# EAGLE design 2RelayModule (EAGLE 7.4.0)
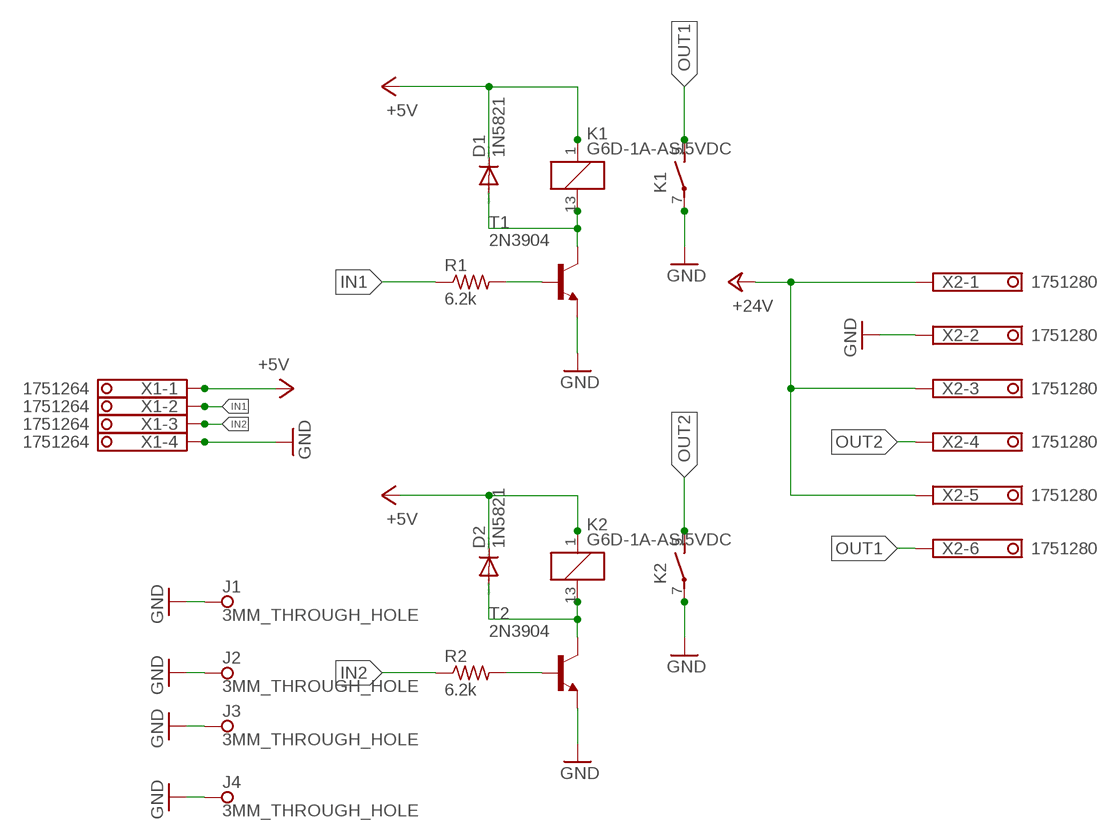
[diagram p0: schematic, sheet 1]

## Parts
D1  1N5821  1N4004  [DO41-10]
D2  1N5821  1N4004  [DO41-10]
J1  3MM_THROUGH_HOLE  [3MM_THROUGH_HOLE]
J2  3MM_THROUGH_HOLE  [3MM_THROUGH_HOLE]
J3  3MM_THROUGH_HOLE  [3MM_THROUGH_HOLE]
J4  3MM_THROUGH_HOLE  [3MM_THROUGH_HOLE]
K1  G6D-1A-ASI5VDC  [G6D]
K2  G6D-1A-ASI5VDC  [G6D]
R1  6.2k  R-US_0207/10  [0207/10]
R2  6.2k  R-US_0207/10  [0207/10]
T1  2N3904  [TO92]
T2  2N3904  [TO92]
X1  1751264  [1751264]
X2  1751280  [1751280]

## Nets
+5V: D1.C D2.C K1.1 K2.1 X1.1
+24V [24V]: X2.1 X2.3 X2.5
GND [GND]: J1.HOLE J2.HOLE J3.HOLE J4.HOLE K1.7(2:P) K2.7(2:P) T1.3(E) T2.3(E) X1.4 X2.2
IN1: R1.1 X1.2
IN2: R2.1 X1.3
N$1: R1.2 T1.2(B)
N$2: R2.2 T2.2(B)
N$3: D1.A K1.13 T1.1(C)
N$4: D2.A K2.13 T2.1(C)
OUT1 [Out]: K1.5(2:S) X2.6
OUT2 [Out]: K2.5(2:S) X2.4

## Library data of the parts
D1 D2 = diode:1N4004: DIODE general purpose rectifier, 1 A
J1-J4 = Genefluidics:3MM_THROUGH_HOLE
K1 K2 = relay:G6D?*: OMRON Slim, Miniature PCB Relay 17.5 × 6.5 × 12.5 mm with Socked Source: http://ecb.omron.com.sg/pdf/relay/power/G6D.pdf; OC_FARNELL: 9812660; OC_NEWARK: unknown
R1 R2 = rcl:R-US_: RESISTOR, American symbol
T1 T2 = transistor:2N3904: NPN TRANSISTOR
X1 = con-phoenix-350:1751264: MKDS 1/ 4-3,5 Printklemme Nennstrom: 10 A Bemessungsspannung: 160 V Raster: 3,5 mm Polzahl: 4 Montageart: Löten Anschlussart: Schraubanschluss Anschlussrichtung vom Leiter zur Platine: 0° Source: http://eshop.phoenixcontact.com .. 1751264.pdf; MPN: 1751264; OC_FARNELL: unknown; OC_NEWARK: 10R0934
X2 = con-phoenix-350:1751280: MKDS 1/ 6-3,5 Printklemme Nennstrom: 10 A Bemessungsspannung: 160 V Raster: 3,5 mm Polzahl: 6 Montageart: Löten Anschlussart: Schraubanschluss Anschlussrichtung vom Leiter zur Platine: 0° Source: http://eshop.phoenixcontact.com .. 1751280.pdf; MPN: 1751280; OC_FARNELL: unknown; OC_NEWARK: 27R1765

## Net classes
0 default: width 0.406 mm, drill 0.508 mm, clearance 0.254 mm
1 24V: width 2.286 mm, drill 0.508 mm, clearance 0.254 mm
2 Out: width 0.889 mm, drill 0.508 mm, clearance 0.254 mm
3 GND: width 0.508 mm, drill 0.508 mm, clearance 0.254 mm

## Board
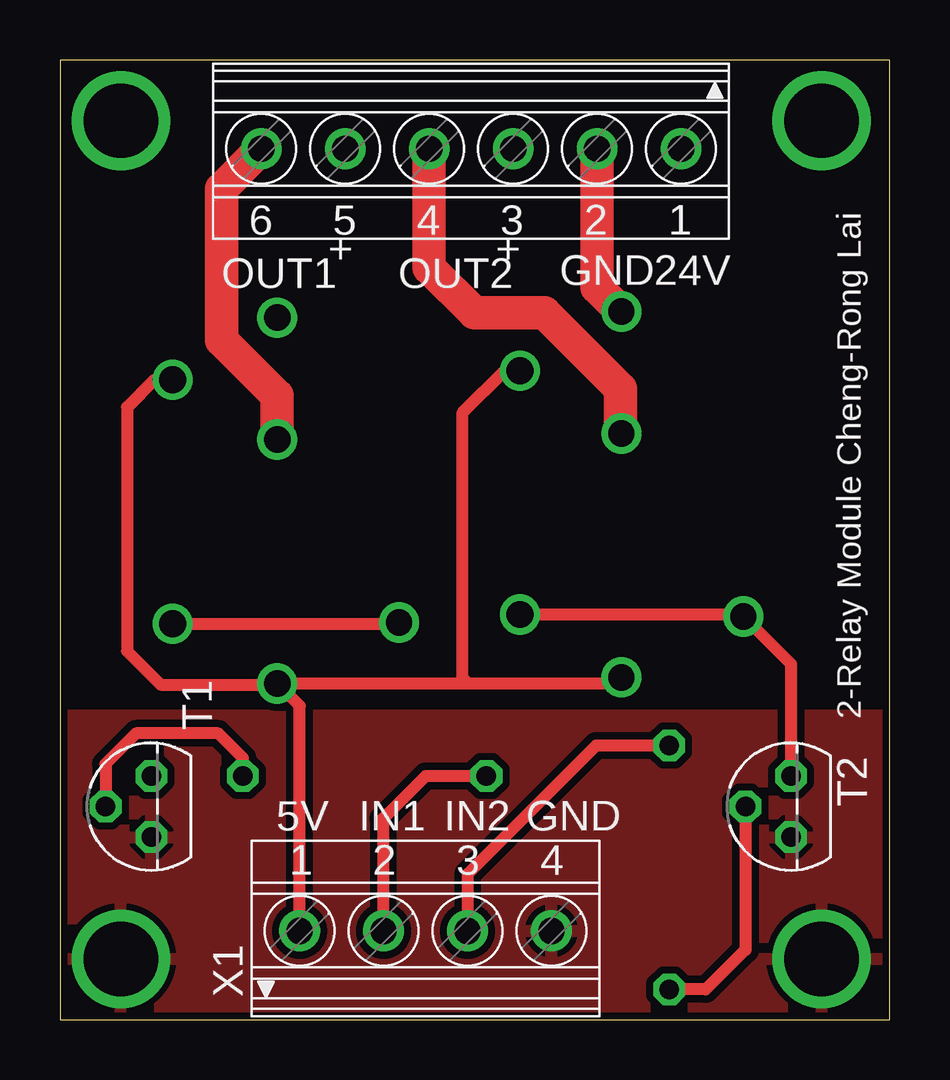
[diagram p1: board, top side]
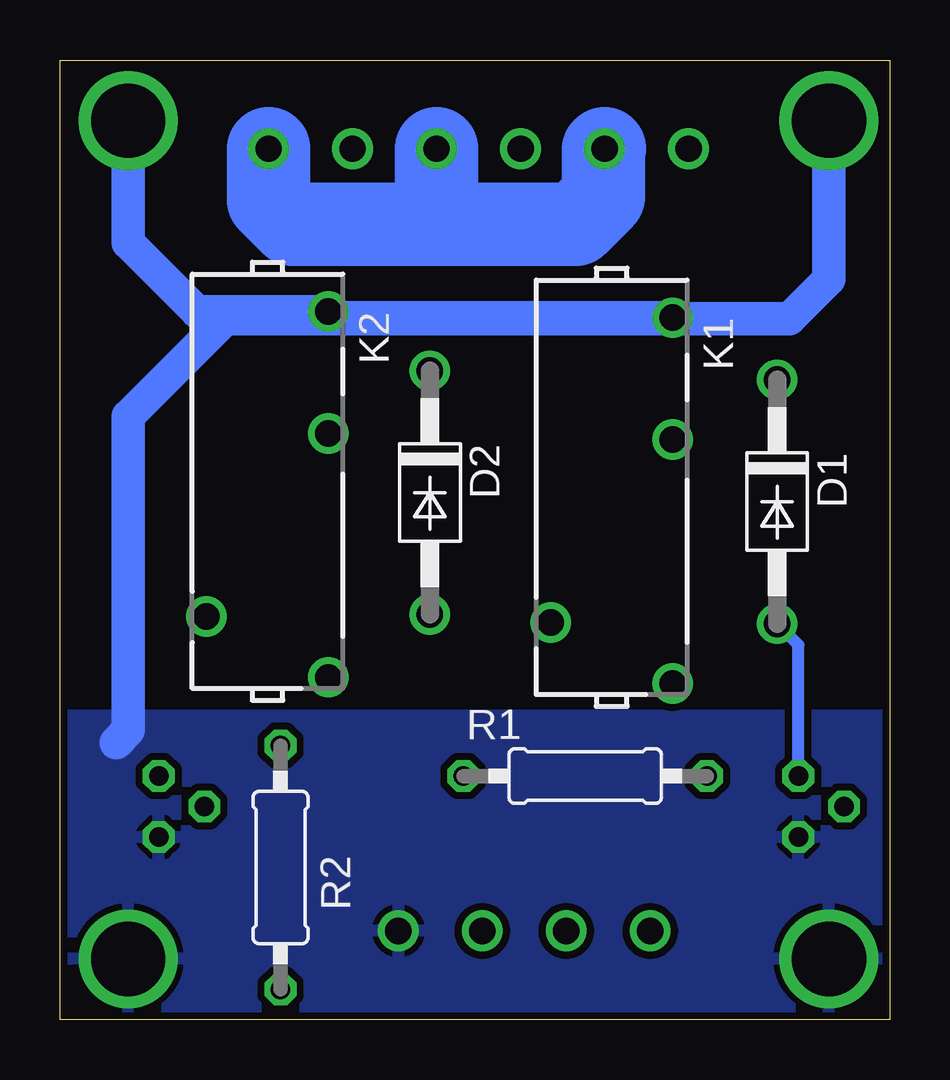
[diagram p2: board, bottom side, seen from below]

Size 34.59 x 39.99 mm. Coordinates in mm from the lower left corner, seen from the top.
Outline: 0,0 34.59,0 34.59,39.99 0,39.99 0,0
Copper layers (1*16): Top 0.035mm / dielectric 1.5mm / Bottom 0.035mm
Design rules "SeeedStudio_2layer_DRU_no_angle_20140221": minimum track width 6mil, minimum drill 12mil, track to track 6mil, track to pad 6mil, pad to pad 6mil, via to via 6mil, smd to smd 0mil, copper to edge 10mil, drill to drill 10mil, minimum pad ring 10mil, minimum via ring 6mil, stop-mask expansion 2mil, vias tented up to drill 100mil, thermal gap 10mil

### Footprints (pad centres in the part's own frame; a part is rotated, then mirrored left to right if it is on the bottom)
DO41-10 = drill 1.118: A 5.08,0; C -5.08,0
3MM_THROUGH_HOLE = drill 3.1: HOLE 0,0
G6D = drill 1.1 pad 1.676: 1 8.08,2.5; 5 -2.08,2.5; 7 -7.16,2.5; 13 5.54,-2.58
0207/10 = drill 0.813 octagon: 1 -5.08,0; 2 5.08,0
TO92 = drill 0.813 octagon: 1 1.27,0; 2 0,1.905; 3 -1.27,0
1751264 = drill 1.1 pad 1.7: 1 -5.25,-0.1; 2 -1.75,-0.1; 3 1.75,-0.1; 4 5.25,-0.1
1751280 = drill 1.1 pad 1.7: 1 -8.75,-0.1; 2 -5.25,-0.1; 3 -1.75,-0.1; 4 1.75,-0.1; 5 5.25,-0.1; 6 8.75,-0.1

### Placement (x,y rotation side)
D1  4.7,21.59 270 bottom
D2  19.18,21.97 270 bottom
J1  2.54,2.54 0 top
J2  31.75,2.54 0 top
J3  2.54,37.47 0 top
J4  31.75,37.47 0 top
K1  11.56,22.1 270 bottom
K2  25.91,22.35 270 bottom
R1  12.7,10.16 0 bottom
R2  25.4,6.35 270 bottom
T1  3.81,8.89 90 top
T2  30.48,8.89 90 top
X1  15.24,3.81 0 top
X2  17.14,36.2 180 top

### Tracks (layer width: path | path; a pad name or v marks a point on that pad's centre or on a via)
+5V
  Top 0.508: D1.C 3.94,26.67 2.79,25.53 2.79,15.37 4.19,13.97 9.01,13.97 K1.1 | K1.1 17.02,14.02 | 17.02,14.02 23.15,14.02 K2.1 | D2.C 18.54,27.05 16.76,25.27 16.76,14.27 17.02,14.02 | X1.1 9.99,13.09 K1.1
+24V
  Bottom 3.48: X2.1 25.89,34.15 24.89,33.15 18.92,33.15 | 18.92,33.15 13.08,33.15 11.94,34.29 11.94,36.25 X2.5 | X2.3 18.89,33.17 18.92,33.15
GND
  Top 1.397: X2.2 22.39,30.52 K2.7
  Bottom 1.397: J3.HOLE 2.54,30.86 4.19,29.21 9.01,29.21 | 9.01,29.21 K1.7 23.15,29.26 K2.7 28.88,29.51 31.75,32.38 J4.HOLE | 9.01,29.21 27.69,29.21 31.75,25.15 31.75,12.06 32.26,11.56
  pour Top (isolate 0.305): 0,12.7 36.83,12.7 36.83,-1.27 -1.27,-1.27 -1.27,12.7
  pour Bottom (isolate 0.305): -2.54,12.7 -2.54,-2.54 38.1,-2.54 38.1,12.7
IN1
  Top 0.508: R1.1 15.24,10.16 13.46,8.38 13.46,3.74 X1.2
IN2
  Top 0.508: R2.1 22.35,11.43 16.99,6.07 X1.3
N$1
  Top 0.508: R1.2 7.62,10.92 6.6,11.94 3.17,11.94 1.91,10.67 T1.2
N$2
  Top 0.508: T2.2 28.57,2.92 26.92,1.27 R2.2
N$3
  Top 0.508: D1.A 14.09,16.51 K1.13
  Bottom 0.508: T1.1 3.81,15.62 D1.A
N$4
  Top 0.508: D2.A 28.31,16.89 K2.13 30.48,14.82 T2.1
OUT1
  Top 1.397: X2.6 6.73,34.63 6.73,28.32 9.06,26 K1.5
OUT2
  Top 1.397: X2.4 15.39,31.34 17.27,29.46 20.19,29.46 23.37,26.29 23.37,24.47 K2.5

### Text on the board
tPlace: + | + | GND | 24V | OUT1 | OUT2 | 5V | IN1 | IN2 | GND
tNames: 2-Relay Module Cheng-Rong Lai